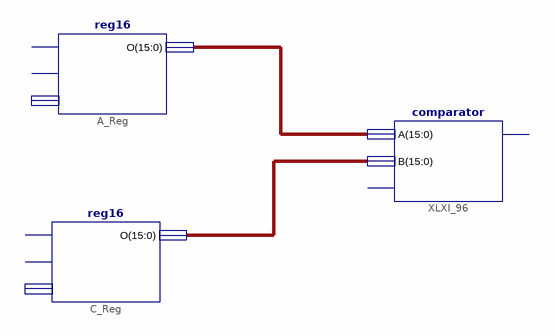
[diagram p0: schematic sheet 1]
// Xilinx ISE schematic beq.sch (spartan3adsp) as structural Verilog: 3 symbols, 0 ports
module beq (
);

  wire [15:0] XLXN_1, XLXN_2;

  reg16 A_Reg (.O(XLXN_1));  // open: CLK, Write, I
  reg16 C_Reg (.O(XLXN_2));  // open: CLK, Write, I
  comparator XLXI_96 (.A(XLXN_1), .B(XLXN_2));  // open: EorNE, BranchDecide
endmodule
